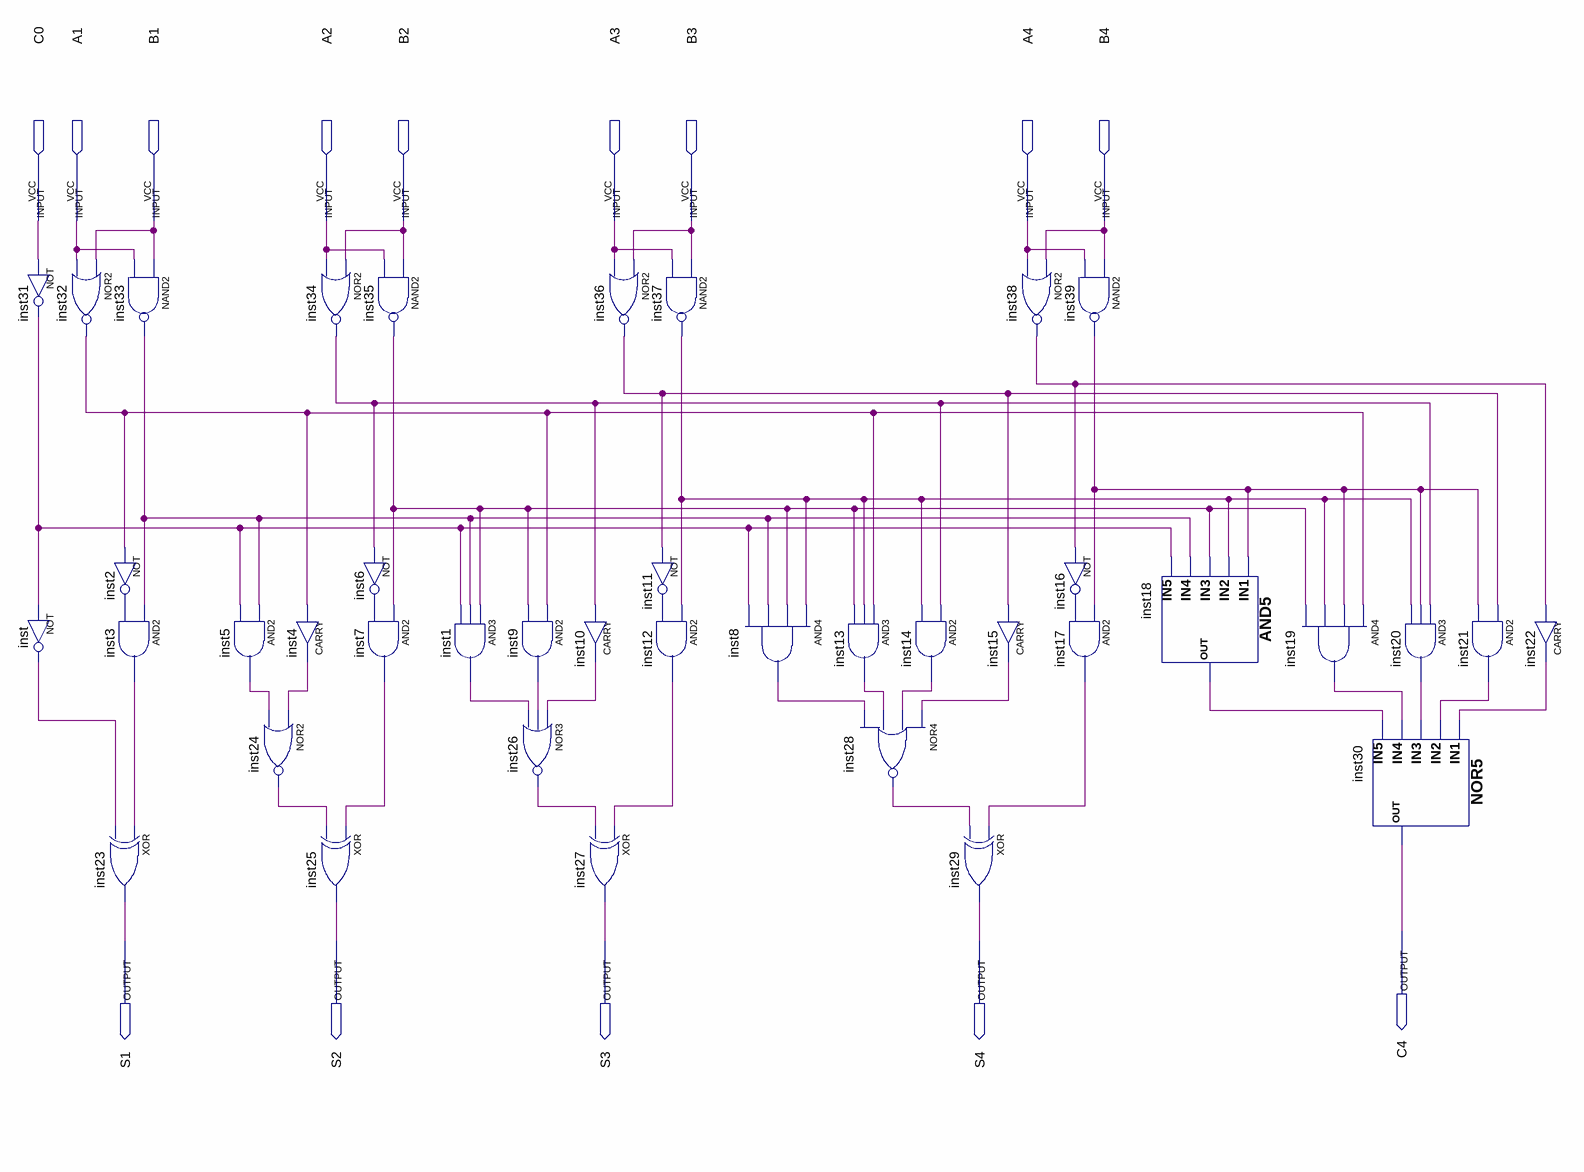
[diagram p0: schematic sheet]
// Quartus schematic 74LS283.bdf as structural Verilog: 40 symbols, 14 pins
module \74LS283  (
  input  C0,
  input  A1,
  input  B1,
  input  A2,
  input  B2,
  input  A3,
  input  B3,
  input  A4,
  input  B4,
  output C4,
  output S1,
  output S2,
  output S3,
  output S4
);

  wire inst1_out, inst2_out, inst3_out, inst4_out, inst5_out, inst6_out, inst7_out, inst8_out, inst9_out,
       inst10_out, inst11_out, inst12_out, inst13_out, inst14_out, inst15_out, inst16_out, inst17_out,
       inst18_out, inst19_out, inst20_out, inst21_out, inst22_out, inst24_out, inst26_out, inst28_out,
       inst31_out, inst32_out, inst33_out, inst34_out, inst35_out, inst36_out, inst37_out, inst38_out,
       inst39_out, inst_out;

  not inst31 (inst31_out, C0);
  not inst (inst_out, inst31_out);
  nor inst32 (inst32_out, B1, A1);
  nand inst33 (inst33_out, B1, A1);
  not inst2 (inst2_out, inst32_out);
  and inst3 (inst3_out, inst33_out, inst2_out);
  xor inst23 (S1, inst3_out, inst_out);
  and inst5 (inst5_out, inst33_out, inst31_out);
  nor inst24 (inst24_out, inst4_out, inst5_out);
  nor inst34 (inst34_out, B2, A2);
  not inst6 (inst6_out, inst34_out);
  CARRY inst4 (.IN(inst32_out), .OUT(inst4_out));
  and inst7 (inst7_out, inst35_out, inst6_out);
  xor inst25 (S2, inst7_out, inst24_out);
  nand inst35 (inst35_out, B2, A2);
  and inst9 (inst9_out, inst32_out, inst35_out);
  and inst1 (inst1_out, inst35_out, inst33_out, inst31_out);
  nor inst26 (inst26_out, inst10_out, inst9_out, inst1_out);
  CARRY inst10 (.IN(inst34_out), .OUT(inst10_out));
  xor inst27 (S3, inst12_out, inst26_out);
  nor inst36 (inst36_out, B3, A3);
  nand inst37 (inst37_out, B3, A3);
  not inst11 (inst11_out, inst36_out);
  and inst12 (inst12_out, inst37_out, inst11_out);
  and inst8 (inst8_out, inst37_out, inst35_out, inst33_out, inst31_out);
  and inst13 (inst13_out, inst32_out, inst37_out, inst35_out);
  nor inst28 (inst28_out, inst15_out, inst14_out, inst13_out, inst8_out);
  and inst14 (inst14_out, inst34_out, inst37_out);
  xor inst29 (S4, inst17_out, inst28_out);
  nor inst38 (inst38_out, B4, A4);
  CARRY inst15 (.IN(inst36_out), .OUT(inst15_out));
  nand inst39 (inst39_out, B4, A4);
  not inst16 (inst16_out, inst38_out);
  and inst17 (inst17_out, inst39_out, inst16_out);
  and inst18 (inst18_out, inst39_out, inst37_out, inst35_out, inst33_out, inst31_out);
  and inst19 (inst19_out, inst32_out, inst39_out, inst37_out, inst35_out);
  nor inst30 (C4, inst22_out, inst21_out, inst20_out, inst19_out, inst18_out);
  and inst20 (inst20_out, inst34_out, inst39_out, inst37_out);
  and inst21 (inst21_out, inst36_out, inst39_out);
  CARRY inst22 (.IN(inst38_out), .OUT(inst22_out));
endmodule
